# Altium project Batterie-Modul.PrjPcb
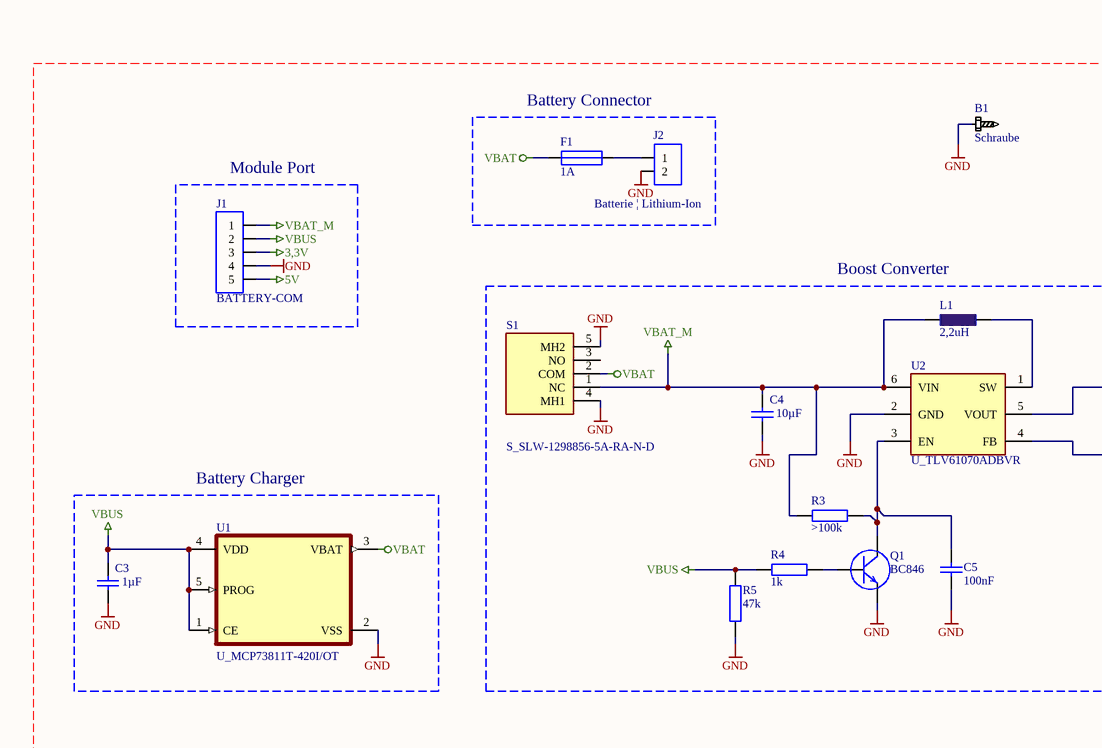
[diagram p0: Sheet2.SchDoc, top left]
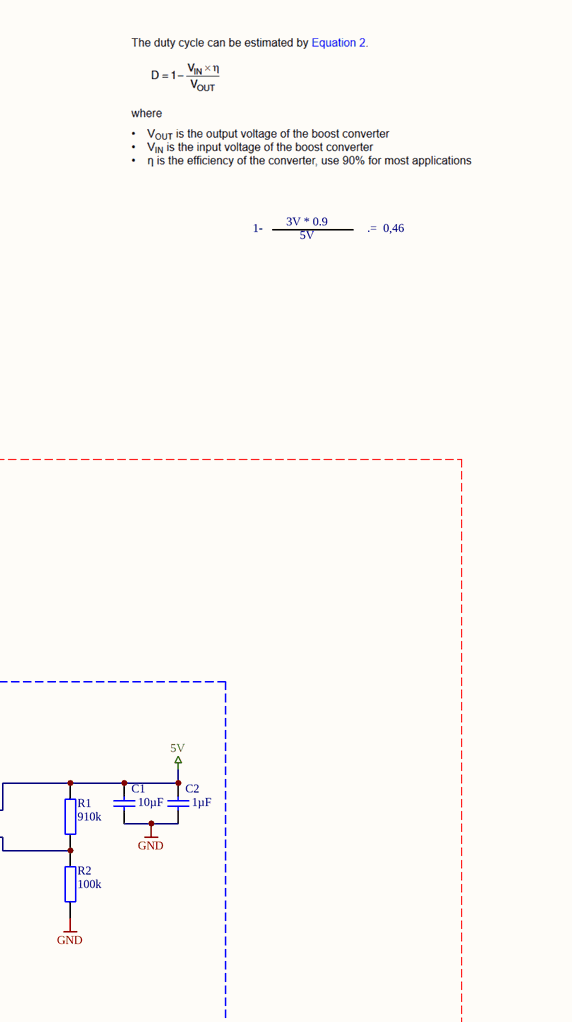
[diagram p1: Sheet2.SchDoc, top right]
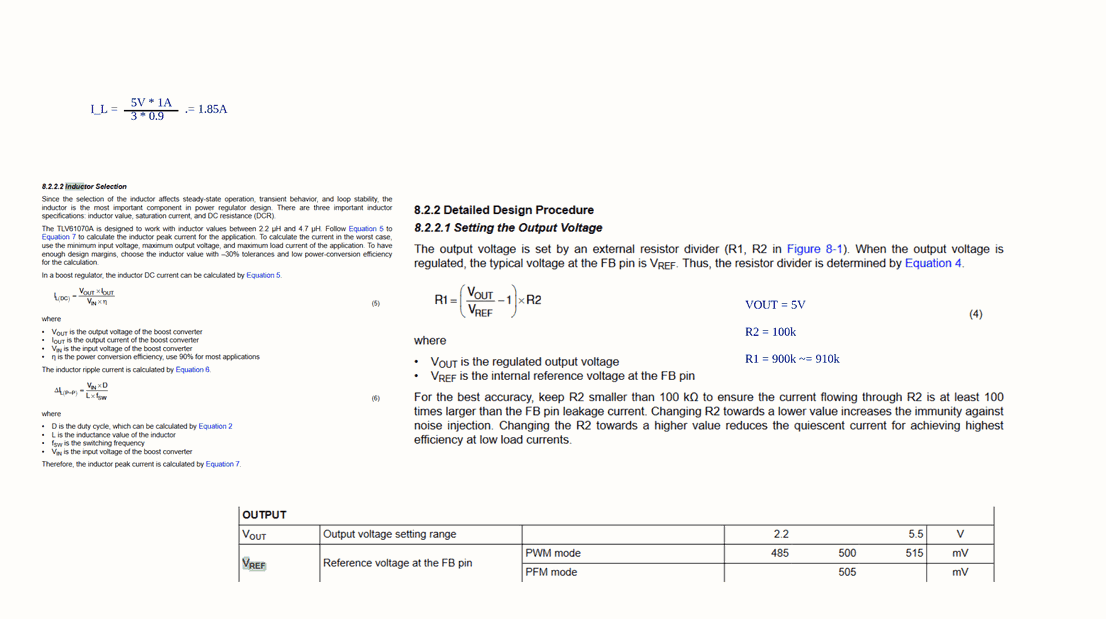
[diagram p2: Sheet2.SchDoc, bottom left]
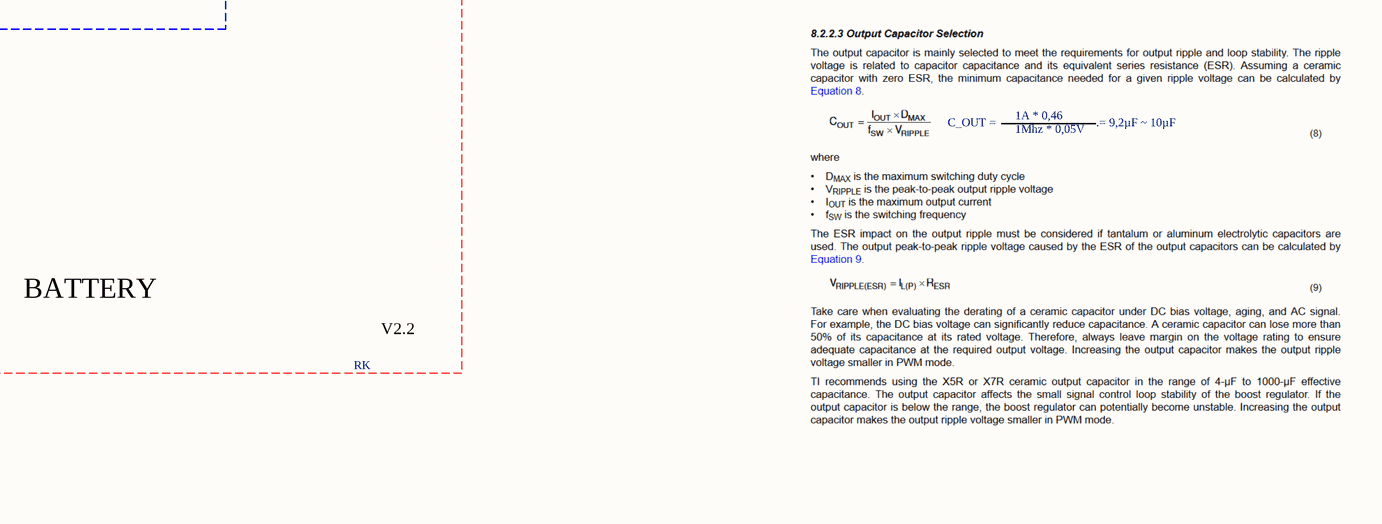
[diagram p3: Sheet2.SchDoc, bottom right]
1 sheet, 19 parts. Net scope: global (net labels, ports and power ports of the same name join across sheets).
Board file: PCB1.PcbDoc

## Sheet Sheet2.SchDoc
size A4; SheetNumber: 1; SheetTotal: 1

### Parts
B1  Schraube  [B_Schraube-M3 PAD]
C1  10µF  [C_SMD_0805]
C2  1µF  [C_SMD_0805]
C3  1µF  [C_SMD_0805]
C4  10µF  [C_SMD_0805]
C5  100nF  [C_SMD_0603]
F1  1A  [F_OMF63_Schurtner]
J1  BATTERY-COM  [SIP-5]
J2  Batterie | Lithium-Ion  [J_THT_Printklemme 2x]
L1  2,2uH  [L_SMD_74438357100]
Q1  BC846  [SOT-23-3_BC846]
R1  910k  [R_SMD_0805]
R2  100k  [R_SMD_0805]
R3  >100k  [R_SMD_0805]
R4  1k  [R_SMD_0805]
R5  47k  [R_SMD_0805]
S1  S_SLW-1298856-5A-RA-N-D  [SLW12988565ARAND]
U1  U_MCP73811T-420I/OT  [SOT95P280X145-5N]
U2  U_TLV61070ADBVR  [SOT23-6]

### Blocks framed on the sheet
Battery Connector: F1 J2
Module Port: J1
Boost Converter: C1 C2 C4 C5 L1 Q1 R1-R5 S1 U2
Battery Charger: C3 U1

### Nets
3,3V: J1.3
5V: C1.1 C2.1 J1.5 R1.2 U2.5(VOUT)
GND: B1.1(PAD) C1.2 C2.2 C3.2 C4.2 C5.2 J1.4 J2.2 Q1.E R2.1 R5.1 S1.4(MH1) S1.5(MH2) U1.2(VSS) U2.2(GND)
VBAT: F1.1 S1.2(COM) U1.3(VBAT)
VBAT_M: C4.1 J1.1 L1.2 R3.1 S1.1(NC) U2.6(VIN)
VBUS: C3.1 J1.2 R4.1 R5.2 U1.1(CE) U1.4(VDD) U1.5(PROG)
NetC5_1: C5.1 Q1.C R3.2 U2.3(EN)
NetF1_2: F1.2 J2.1
NetL1_1: L1.1 U2.1(SW)
NetQ1_B: Q1.B R4.2
NetR1_1: R1.1 R2.2 U2.4(FB)

Not connected (* = marked no-connect by the designer): S1 3(NO)

### Notes on the sheet
- 1-
- 3V * 0.9
- 5V
- .=  0,46
- C_OUT =
- 1A * 0,46
- 1Mhz * 0,05V
- .= 9,2µF ~ 10µF
- BATTERY
- V2.2
- RK
- I_L =
- 5V * 1A
- 3 * 0.9
- .= 1.85A
- VOUT = 5V
- R2 = 100k
- R1 = 900k ~= 910k

### Library data of the parts
B1 = B_Schraube: Schraubenloch für M3 Schrauben
C1-C5 = C_SMD_KO: Kondensator SMD Universal, Keramik, Folie, usw.; Spannung: *; Bauform: *; Typ: *
F1 = F_THT_Fuse: Sicherung; Strom: *; Auslösecharakteristik: *
J1 = J_THT_CON5: Stecker
J2 = J_THT_CON2: Stecker
L1 = L_SMD_Spule: Spule SMD
Q1 = Q_SMD_NPN: NPN Transistor
R1-R5 = R_SMD_Widerstand: Widerstand SMD
S1 = S_SLW-1298856-5A-RA-N-D: Switch; Manufacturer_Name: Same Sky; Datasheet Link: https://www.sameskydevices.com/product/resource/slw-1298856-5a-ra-n-d.pdf; Height: 6.3mm; Manufacturer_Part_Number: SLW-1298856-5A-RA-N-D
U1 = U_MCP73811T-420I/OT: Charger IC Lithium Ion/Polymer SOT-23-5; MF: Microchip; Availability: In Stock; SnapEDA_Link: https://www.snapeda.com/parts/MCP73811T-420I/OT/Microchip/view-part/?ref=snap; Price: None; Check_prices: https://www.snapeda.com/parts/MCP73811T-420I/OT/Microchip/view-part/?ref=eda; Package: SOT-23 Microchip; MP: MCP73811T-420I/OT; Value: *; Purchase-URL: https://pricing.snapeda.com/search/part/MCP73811T-420I/OT/?ref=eda
U2 = U_TLV61070ADBVR: Integrated Circuit, Boost converter: Input 0.5 - 5.5V / Output 2.2 - 5.5V; Manufacturer_Name: Texas Instruments; Datasheet Link: https://www.ti.com/lit/ds/symlink/tlv61070a.pdf?HQS=dis-mous-null-mousermode-dsf-pf-null-wwe&ts=1668211309833&ref_url=https%253A%252F%252Fwww.mouser.com%252F; Height: 1.45mm; Manufacturer_Part_Number: TLV61070ADBVR; Mouser Part Number: 595-TLV61070ADBVR; Mouser Price/Stock: https://www.mouser.co.uk/ProductDetail/Texas-Instruments/TLV61070ADBVR?qs=T%252BzbugeAwjhLlT1empixsw%3D%3D; Arrow Part Number: TLV61070ADBVR; Arrow Price/Stock: https://www.arrow.com/en/products/tlv61070adbvr/texas-instruments?region=europe